# EAGLE design ASD2205 (EAGLE 6.3)
DATABASE: ./../../../../../Components/TinyCircuits_Part_Database.txt
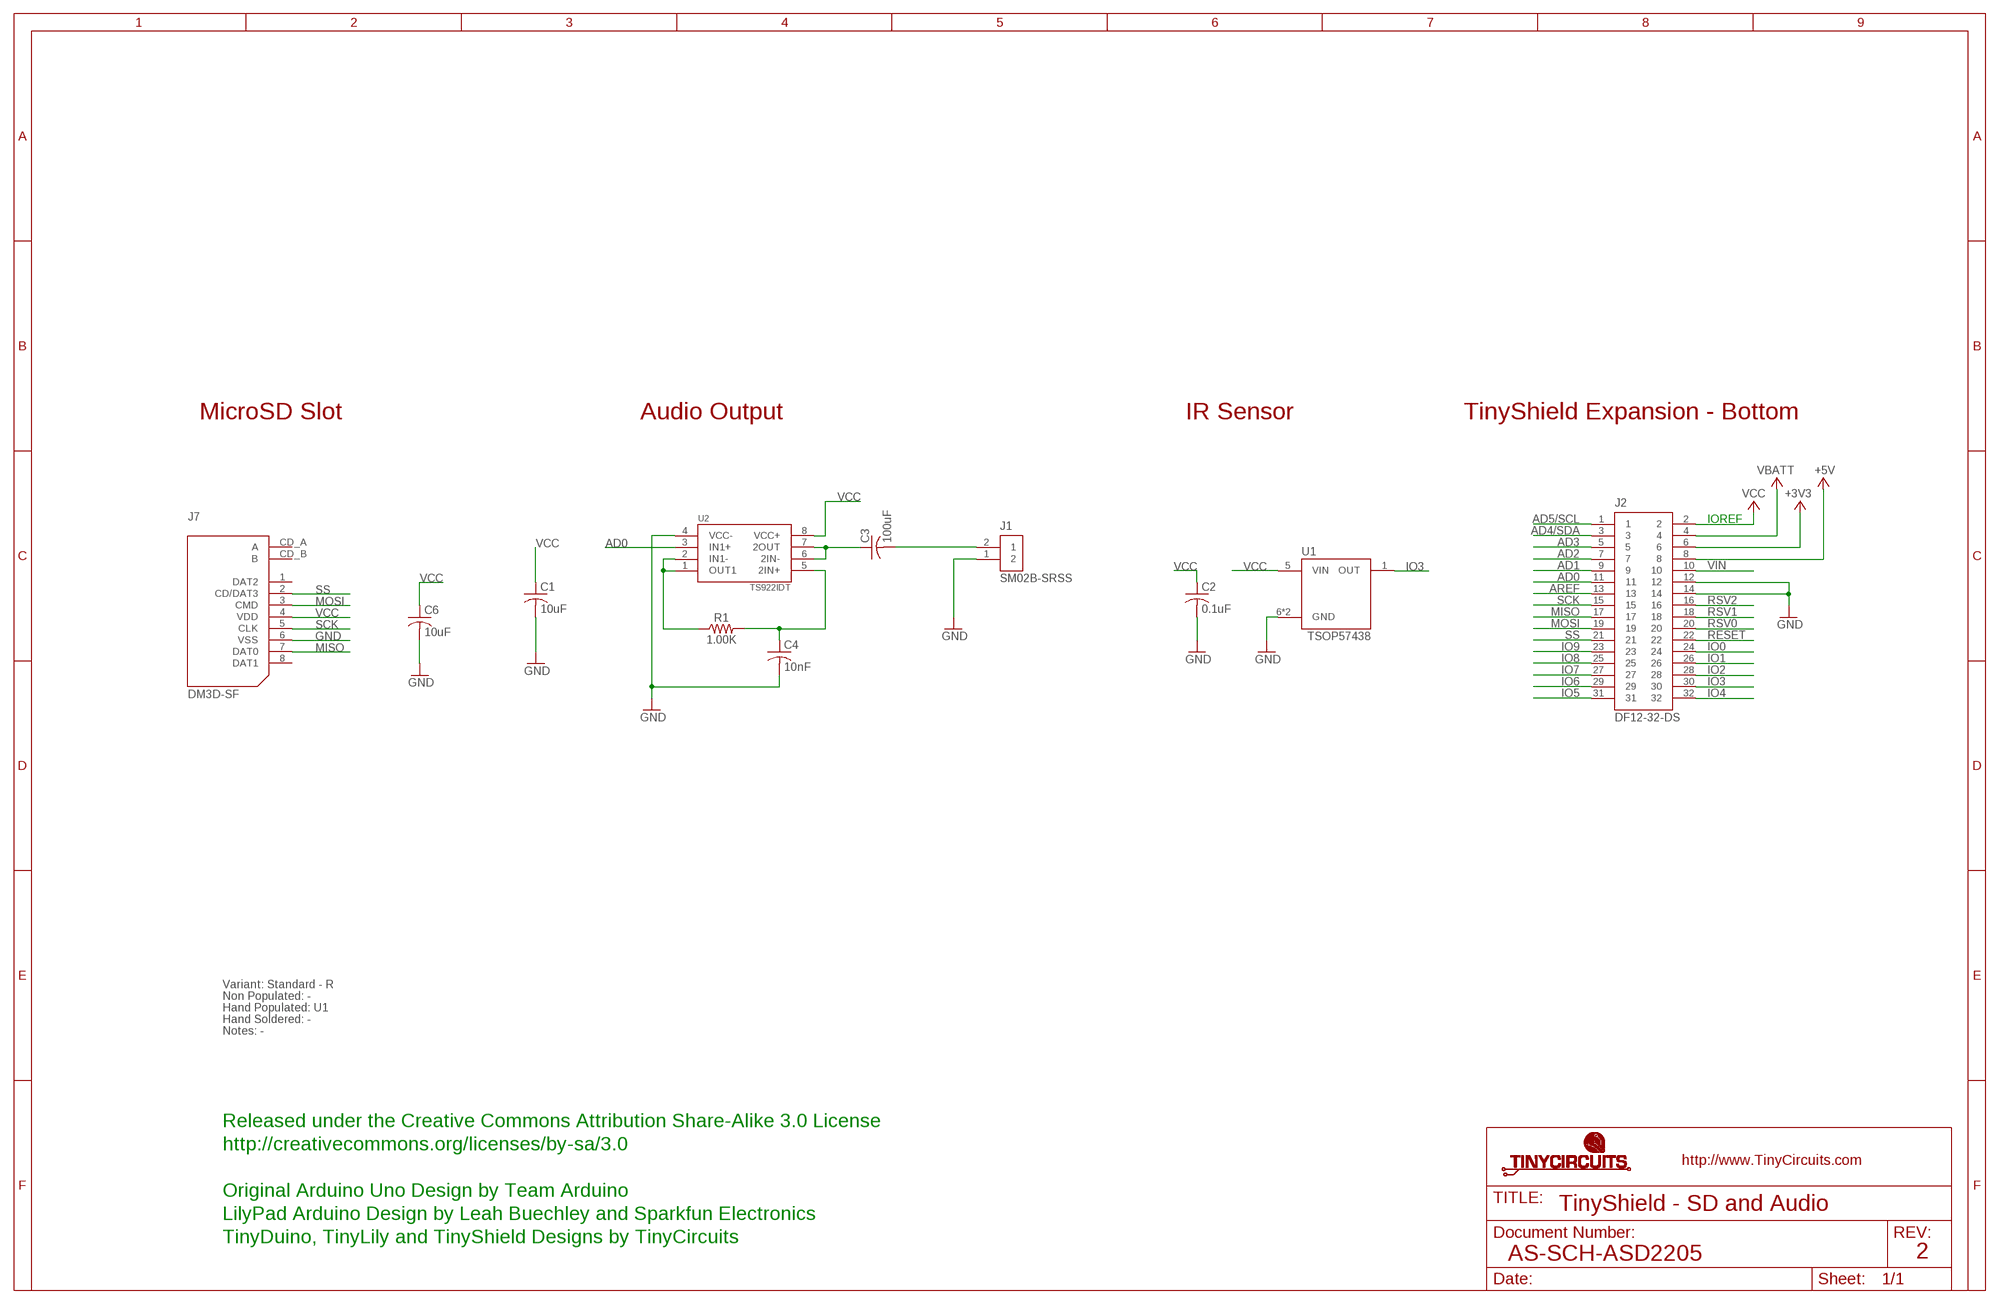
[diagram p0: schematic, sheet 1]

## Parts
C1  10uF  AS-ITM-00002  [C0603]
C2  0.1uF  AS-ITM-00008  [C0402]
C3  100uF  AS-ITM-00095  [C1206]
C4  10nF  AS-ITM-00084  [C0402]
C6  10uF  AS-ITM-00002  [C0603]
J1  SM02B-SRSS  AS-ITM-00231  [JST_SH_2X1]
J2  DF12-32-DS  AS-ITM-00012  [DF12-32-DS]
J7  DM3D-SF  AS-ITM-00047  [SD_CARD]
R1  1.00K  AS-ITM-00003  [0402]
U1  TSOP57438  AS-ITM-00360  [TSOP57]
U2  TS922IDT  AS-ITM-000922  [SO-08-COMPACT]

## Nets
+3V3: J2.6
+5V: J2.8
AD0: J2.11 U2.3(IN1+)
AD1: J2.9
AD2: J2.7
AD3: J2.5
AD4/SDA: J2.3
AD5/SCL: J2.1
AREF: J2.13
GND: C1.2 C2.2 C4.2 C6.2 J1.1 J2.12 J2.14 J7.6(VSS) U1.6(GND) U1.8(GND) U2.4(VCC-)
IO0: J2.24
IO1: J2.26
IO2: J2.28
IO3: J2.30 U1.1(OUT)
IO4: J2.32
IO5: J2.31
IO6: J2.29
IO7: J2.27
IO8: J2.25
IO9: J2.23
MISO: J2.17 J7.7(DAT0)
MOSI: J2.19 J7.3(CMD)
N$1: C3.1 U2.6(2IN-) U2.7(2OUT)
N$2: C3.2 J1.2
N$7: C4.1 R1.2 U2.5(2IN+)
N$9: R1.1 U2.1(OUT1) U2.2(IN1-)
RESET: J2.22
RSV0: J2.20
RSV1: J2.18
RSV2: J2.16
SCK: J2.15 J7.5(CLK)
SS: J2.21 J7.2(CD/DAT3)
VBATT: J2.4
VCC: C1.1 C2.1 C6.1 J2.2 J7.4(VDD) U1.5(VIN) U2.8(VCC+)
VIN: J2.10
Unconnected: J7.1(DAT2) J7.8(DAT1) J7.CD_A(A) J7.CD_B(B)

## Notes on the sheet
- MicroSD Slot | Audio Output | IR Sensor | TinyShield Expansion - Bottom
- IOREF
- Variant: Standard - R
- Non Populated: -
- Hand Populated: U1
- Hand Soldered: -
- Notes: -
- Released under the Creative Commons Attribution Share-Alike 3.0 License
- http://creativecommons.org/licenses/by-sa/3.0
- Original Arduino Uno Design by Team Arduino
- TinyShield - SD and Audio
- LilyPad Arduino Design by Leah Buechley and Sparkfun Electronics
- TinyDuino, TinyLily and TinyShield Designs by TinyCircuits
- AS-SCH-ASD2205 | 2

## Library data of the parts
C1 C6 = tinycircuits:AS-ITM-00002: CAP CER 10UF 10V 20% X5R 0603; PARTNO: AS-ITM-00002
C2 = tinycircuits:AS-ITM-00008: CAP CER 0.1UF 16V 10% X5R 0402; PARTNO: AS-ITM-00008
C3 = tinycircuits:AS-ITM-00095: CAP CER 100UF 10V 20% X5R 1206; PARTNO: AS-ITM-00095
C4 = tinycircuits:AS-ITM-00084: CAP CER 10NF 25V 10% X7R 0402; PARTNO: AS-ITM-00084
J1 = tinycircuits:AS-ITM-00231: CONN HEADER SH 2POS SIDE 1MM; PARTNO: AS-ITM-00231; PNPROTATION: 180; VALUE: SM02B-SRSS-TB(LF)(SN)
J2 = tinycircuits:AS-ITM-00012: CONN RECEPT 32POS 3MM SMD 0.5MM; PARTNO: AS-ITM-00012
J7 = tinycircuits:AS-ITM-00047: CONN MICRO SD R/A PUSH-PULL SMD; PARTNO: AS-ITM-00047
R1 = tinycircuits:AS-ITM-00003: RES 1.00K OHM 1/16W 1% 0402; PARTNO: AS-ITM-00003
U1 = tinycircuits:AS-ITM-00360: IC IR RCVR MOD 38KHZ; PARTNO: AS-ITM-00360
U2 = tinycircuits:AS-ITM-00092: IC OPAMP GP 4MHZ RRO 8SO; PARTNO: AS-ITM-00092

## Board
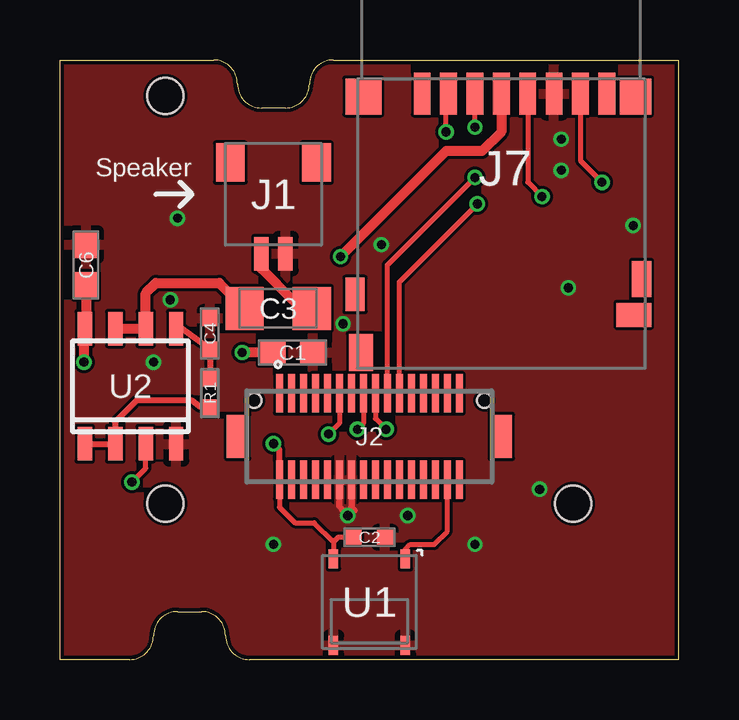
[diagram p1: board, top side]
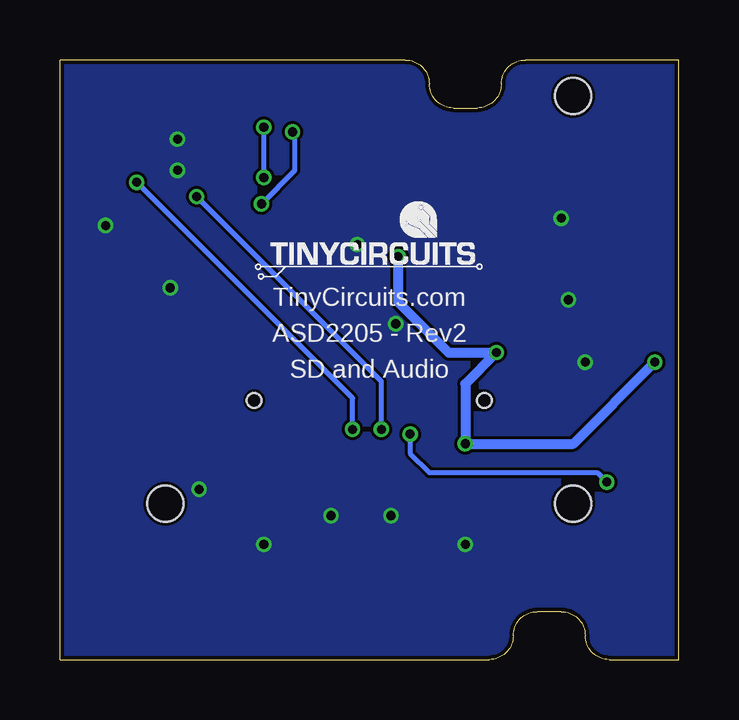
[diagram p2: board, bottom side, seen from below]

Size 25.8 x 25 mm. Coordinates in mm from the lower left corner, seen from the top.
Outline: 0,25 6.4,25 arc-90 7.4,24 arc90 8.4,23 9.4,23 arc90 10.4,24 arc-90 11.4,25 25.8,25 25.8,0 7.9,0 arc-90 6.9,1 arc90 5.9,2 4.9,2 arc90 3.9,1 arc-90 2.9,0 0,0 0,25
Copper layers (1*16): Top 0.035mm / dielectric 1.5mm / Bottom 0.035mm
Design rules "default *": minimum track width 8mil, minimum drill 15mil, track to track 5mil, track to pad 5mil, pad to pad 5mil, via to via 6mil, smd to smd 5mil, copper to edge 6mil, drill to drill 8mil, minimum pad ring 10mil, minimum via ring 5mil, stop-mask expansion 4mil, vias tented up to drill 25mil, thermal gap 10mil
Holes 1.5 mm at 4.4,23.5 21.4,6.5 4.4,6.5

### Footprints (pad centres in the part's own frame; a part is rotated, then mirrored left to right if it is on the bottom)
C0603 = smd 1.1 x 1: 1 -0.85,0; 2 0.85,0
C0402 = smd 0.65 x 0.6: 1 -0.65,0; 2 0.65,0
C1206 = smd 1.6 x 1.8: 1 -1.4,0; 2 1.4,0
JST_SH_2X1 = smd 0.6 x 1.4: 1 -0.5,2.475; 2 0.5,2.475 | smd 1.2 x 1.6: PAD1 -1.8,-1.325; PAD2 1.8,-1.325
DF12-32-DS = smd 0.3 x 1.6: 1 -3.75,1.8; 2 -3.75,-1.8; 3 -3.25,1.8; 4 -3.25,-1.8; 5 -2.75,1.8; 6 -2.75,-1.8; 7 -2.25,1.8; 8 -2.25,-1.8; 9 -1.75,1.8; 10 -1.75,-1.8; 11 -1.25,1.8; 12 -1.25,-1.8; 13 -0.75,1.8; 14 -0.75,-1.8; 15 -0.25,1.8; 16 -0.25,-1.8; 17 0.25,1.8; 18 0.25,-1.8; 19 0.75,1.8; 20 0.75,-1.8; 21 1.25,1.8; 22 1.25,-1.8; 23 1.75,1.8; 24 1.75,-1.8; 25 2.25,1.8; 26 2.25,-1.8; 27 2.75,1.8; 28 2.75,-1.8; 29 3.25,1.8; 30 3.25,-1.8; 31 3.75,1.8; 32 3.75,-1.8 | smd 0.9 x 1.8: F1 -5.5,0; F2 5.5,0 | hole 0.6: -4.8,1.5; 4.8,1.5
SD_CARD = smd 0.7 x 1.75: 1 3.3,0; 2 2.2,0; 3 1.1,0; 4 0,0; 5 -1.1,0; 6 -2.2,0; 7 -3.3,0; 8 -4.4,0 | smd 1.3 x 1.5: 9 -5.6,0.125 | smd 1.5 x 1.5: 10 5.75,0.125 | smd 0.8 x 1.5: 11 -5.85,7.725 | smd 0.8 x 1.4: 13 6.1,8.375 | smd 1 x 1.55: CD_A 5.85,10.8 | smd 1.45 x 1: CD_B -5.525,9.225
0402 = smd 0.65 x 0.55: 1 -0.6,0; 2 0.6,0
TSOP57 = smd 0.4 x 0.8: 1 -1.5,-1.8; 5 1.5,-1.8; 6 1.5,1.8; 8 -1.5,1.8
SO-08-COMPACT = smd 0.6 x 1.4: 1 -1.905,-2.4; 2 -0.635,-2.4; 3 0.635,-2.4; 4 1.905,-2.4; 5 1.905,2.4; 6 0.635,2.4; 7 -0.635,2.4; 8 -1.905,2.4

### Placement (x,y rotation side)
C1  9.7,12.8 0 top
C2  12.9,5.1 0 top
C3  9.1,14.64 0 top
C4  6.25,13.59 90 top
C6  1.09,16.45 90 top
J1  8.9,19.4 180 top
J2  12.9,9.3 0 top
J7  18.4,23.6 180 top
R1  6.25,11.11 90 top
U1  12.9,2.4 180 top
U2  2.94,11.4 0 top
U$1  [DOCFIELD-TINYCIRCUITS-PCB]  36.81,-5 0 top  (outside the outline)

### Tracks (layer width: path | path; a pad name or v marks a point on that pad's centre or on a via)
AD0  (via drill 0.38)
  Top 0.203: J2.11 11.65,9.85 v11.2,9.4 | v3,7.4 3.58,7.97 U2.3
  Bottom 0.203: v11.2,9.4 11.2,8.6 10.4,7.8 3.4,7.8 v3,7.4
GND  (via drill 0.38)
  Top 0.254: J2.14 12.15,6.35 12.3,6.2 11.8,6.2 11.65,6.4 11.65,7.4 11.7,7.5 11.8,7.4
  other vias: 20.9,21.7 12,6 3.9,12.4 4.6,15 23.9,18.1 21.2,15.5 20,7.1 4.9,18.4 11.8,14 13.4,17.3 14.5,6 17.3,4.8 8.9,4.8 20.9,20.4
  pour Top: 0,25 25.8,25 25.8,0 0,0
  pour Bottom: 0,25 25.8,25 25.8,0 0,0
IO3
  Top 0.203: U1.1 14.4,4.6 14.6,4.8 15.6,4.8 16.15,5.35 J2.30
MISO  (via drill 0.38)
  Top 0.203: J2.17 13.15,10.05 v13.6,9.6 | J7.7 21.7,20.8 v22.6,19.9
  Bottom 0.203: v22.6,19.9 13.6,10.9 v13.6,9.6
MOSI  (via drill 0.38)
  Top 0.203: J2.19 13.65,16.45 v17.3,20.1 | v17.3,22.2 J7.3
  Bottom 0.203: v17.3,20.1 v17.3,22.2
N$1
  Top 0.406: U2.7 U2.6 3.58,15.27 4,15.7 6.64,15.7 C3.1
N$2
  Top 0.406: J1.2 8.4,16.3 9.7,15 10.64,14.7 C3.2
N$7
  Top 0.254: U2.5 5.09,13.8 C4.1 R1.2
N$9
  Top 0.254: U2.1 U2.2 2.3,9.9 3.2,10.8 5.5,10.8 5.84,10.54 R1.1
SCK  (via drill 0.38)
  Top 0.203: v12.4,9.6 12.65,9.85 J2.15 | J7.5 19.5,19.9 v20.1,19.3
  Bottom 0.203: v20.1,19.3 12.4,11.6 v12.4,9.6
SS  (via drill 0.38)
  Top 0.203: J2.21 14.15,15.75 v17.4,19 | v16.1,22 16.1,23.5 J7.2
  Bottom 0.203: v17.4,19 16,20.4 16,21.9 v16.1,22
VCC  (via drill 0.38)
  Top 0.203: J2.2 9.15,6.35 9.8,5.7 10.6,5.7 11.4,4.9 | 11.4,4.9 U1.5 | C2.1 11.6,5.1 11.4,4.9
  Top 0.254: J2.2 9.15,8.75 v8.9,9
  Top 0.406: J7.4 18.4,22 17.6,21.2 16.1,21.2 v11.7,16.8 | C6.1 1.09,13.86 U2.8 1,13.77 v1,12.4 | C1.1 v7.6,12.8
  Bottom 0.406: v11.7,16.8 11.7,14.9 9.6,12.8 v7.6,12.8 8.9,11.5 v8.9,9 4.4,9 v1,12.4

### Text on the board
tPlace: Speaker
bPlace: TinyCircuits.com | ASD2205 - Rev2 | SD and Audio
Document: FABRICATION DRAWING | NOTES: | 1. PRINTED CIRCUIT BOARD MADE FROM NEMA GRADE FR-4 EPOXY LAMINATE | WITH 1 OUNCE COPPER PLATING AND .024 THICKNESS. | 2. ALL DIMENSIONS ARE GIVEN IN INCHES. | 3. CIRCUIT PATHS ARE FOR REFERENCE ONLY. | 4. HOLE SIZES SHOWN ARE FINISHED DIAMETERS AFTER PLATING. | 5. BOARD PLATED USING REFLOW OR SIMILAR METHOD. | 6. BOARD TO HAVE BLUE SOLDER MASK ON PLATED SURFACES USING WET FILM | 7. SILKSCREEN BOARD USING WHITE INK. | SR100 OR SR1010 EPOXY. EQUIVALENT WET OR DRY FILM MAY BE USED. | 8. THE FOLLOWING INFORMATION APPLIES TO THIS BOARD: | * 2 COPPER LAYERS | * .024 BOARD THICKNESS | * REQUIRES TOP SIDE SILKSCREEN | Released under the Creative Commons Attribution Share-Alike 3.0 License | http://creativecommons.org/licenses/by-sa/3.0 | Original Arduino Uno Design by Team Arduino | LilyPad Arduino Design by Leah Buechley and Sparkfun Electronics | TinyDuino, TinyLily and TinyShield Designs by TinyCircuits | TinyShield - SD and Audio | AS-PCB-ASD2205 | 2